# Altium schematic sheet 24_to_33V_(for_Ionizer_Chips).SchDoc
size A; SheetNumber: 1; SheetTotal: 2
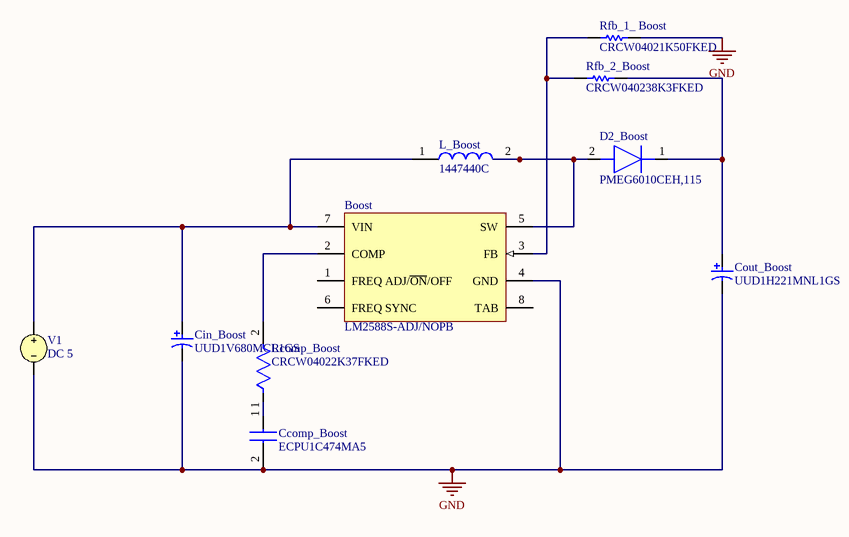
[diagram p0: 24_to_33V_(for_Ionizer_Chips).SchDoc]

## Parts
Boost  LM2588S-ADJ/NOPB  [KTW0007B_N]
Ccomp_Boost  ECPU1C474MA5  [ECPU1C154MA5]
Cin_Boost  UUD1V680MCL1GS  [NIC-CAPA2-6.3X7.7_V]
Cout_Boost  UUD1H221MNL1GS  [NIC-CAPA2-10X10_V]
D2_Boost  PMEG6010CEH,115  [SODFL3516X120N]
L_Boost  1447440C  [1447440C]
Rcomp_Boost  CRCW04022K37FKED  [FP-CRCW0402-e3-IPC_B]
Rfb_1__Boost  CRCW04021K50FKED  [RESC1005X40X25NL05T05]
Rfb_2_Boost  CRCW040238K3FKED  [RESC1005X40X25NL05T05]
V1  DC 5

## Nets
GND: Boost.4(GND) Ccomp_Boost.2 Cin_Boost.2 Cout_Boost.2 Rfb_1__Boost.2 V1.2
NetBoost_2: Boost.2(COMP) Rcomp_Boost.2
NetBoost_3: Boost.3(FB) Rfb_1__Boost.1 Rfb_2_Boost.1
NetBoost_5: Boost.5(SW) D2_Boost.2(A) L_Boost.2
NetBoost_7: Boost.7(VIN) Cin_Boost.1 L_Boost.1 V1.1
NetCcomp_Boost_1: Ccomp_Boost.1 Rcomp_Boost.1
NetCout_Boost_1: Cout_Boost.1 D2_Boost.1(K) Rfb_2_Boost.2

Not connected (* = marked no-connect by the designer): Boost 1(FREQ_ADJ/~{ON}/OFF) 6(FREQ_SYNC) 8(TAB)

## Library data of the parts
Boost = CMP-0069-00054-3: SIMPLE SWITCHER® 5A Flyback Regulator with Shutdown, 7-pin TO-263, Pb-Free; Manufacturer: Texas Instruments; PowerWise: N; PackageTopMarking: NSUZXYTTE#*LM2588S*-ADJ P+; PinCount: 7; PackageReference: KTW0007B; ComponentLink1Description: Datasheet URL; ComponentLink1URL: http://www.ti.com/general/docs/lit/getliterature.tsp?genericPartNumber=LM2588&fileType=pdf; Code_JEDEC: MO-169-AC; RoHS: Y; CompType: Switcher; PackageDescription: TO-263, Molded, .400 x .390 x .180in Body, 7 Lead, .050in Pitch, Surface Mount
Ccomp_Boost = ECPU1C474MA5: Capacitor; Manufacturer_Name: Panasonic; Datasheet Link: http://industrial.panasonic.com/cdbs/www-data/pdf/RDI0000/ABD0000C178.pdf; Manufacturer_Part_Number: ECPU1C474MA5
Cin_Boost = CMP-0687-00064-1: Aluminum Electrolytic Capacitor, UD Series, Low Impedance, 68 uF, 35 V, + / - 20%, -55 to 105 degC, Chip Type, 6.3 x 7.7 mm D x L, Pb-Free, Reel; Manufacturer: Nichicon; Rated Ripple Current (at 100kHz): 280 mA; Rated Capacitance: 68 uF; Impedance: 0.34 Ohm; Rated Voltage: 35 V; Packing: Dia382mm Reel; Endurance Time: 2000 h; Tolerance Rated Capacitance: -20 to 20%; Mounting Technology: Surface Mount; ComponentLink2URL: http://products.nichicon.co.jp/en/pdf/XJA043/e-ud.pdf; ComponentLink1Description: Manufacturer URL; PackageReference: CAPAE-D6.3H7.7; Diameter: 6.3 mm; PackageDescription: 2-Pin Surface Mount Device, Diameter 6.3 mm, Height 7.7 mm, Pitch 5.4 mm; ComponentLink2Description: Datasheet; ComponentLink3Description: Package Specification; RoHS: TRUE; Length: 7.7 mm; DatasheetVersion: 08/2012; ComponentLink1URL: http://www.nichicon.co.jp/; ComponentLink3URL: http://products.nichicon.co.jp/en/pdf/XJA043/e-ud.pdf; PartNumber: UUD1V680MCL1GS
Cout_Boost = CMP-0687-00004-1: Aluminum Electrolytic Capacitor, UD Series, Low Impedance, 220 uF, 50 V, + / - 20%, -55 to 105 degC, Chip Type, 10 x 10 mm D x L, Pb-Free, Reel; Manufacturer: Nichicon; Rated Capacitance: 220 uF; Packing: Dia382mm Reel; Endurance Time: 5000 h; Rated Ripple Current (at 100kHz): 670 mA; Tolerance Rated Capacitance: -20 to 20%; Rated Voltage: 50 V; Impedance: 0.18 Ohm; RoHS: TRUE; ComponentLink2URL: http://products.nichicon.co.jp/en/pdf/XJA043/e-ud.pdf; PartNumber: UUD1H221MNL1GS; ComponentLink3URL: http://products.nichicon.co.jp/en/pdf/XJA043/e-ud.pdf; Mounting Technology: Surface Mount; ComponentLink1Description: Manufacturer URL; ComponentLink3Description: Package Specification; ComponentLink1URL: http://www.nichicon.co.jp/; Diameter: 10 mm; PackageDescription: 2-Pin Surface Mount Device, Diameter 10 mm, Height 10 mm, Pitch 8 mm; PackageReference: CAPAE-D10H10; ComponentLink2Description: Datasheet; DatasheetVersion: 08/2012; Length: 10 mm
D2_Boost = PMEG6010CEH,115: Diode; Manufacturer_Name: Nexperia; Datasheet Link: https://assets.nexperia.com/documents/data-sheet/PMEG6010CEH_PMEG6010CEJ.pdf; Height: 1.2mm; Manufacturer_Part_Number: PMEG6010CEH,115; Mouser Part Number: 771-PMEG6010CEH-T/R; Mouser Price/Stock: https://www.mouser.co.uk/ProductDetail/Nexperia/PMEG6010CEH115?qs=LOCUfHb8d9uyulDQGIpcOA%3D%3D; Arrow Part Number: PMEG6010CEH,115; Arrow Price/Stock: https://www.arrow.com/en/products/pmeg6010ceh115/nexperia?region=europe
L_Boost = 1447440C: Inductor; Manufacturer_Name: Murata Electronics; Datasheet Link: https://www.arrow.com/en/products/1447440c/murata-power-solutions; Manufacturer_Part_Number: 1447440C; Mouser Part Number: 580-1447440C; Mouser Price/Stock: https://www.mouser.co.uk/ProductDetail/Murata-Power-Solutions/1447440C?qs=Gob89d8LFA9gyjWpYAyVrg%3D%3D; Arrow Part Number: 1447440C; Arrow Price/Stock: https://www.arrow.com/en/products/1447440c/murata-power-solutions
Rcomp_Boost = CMP-2002-08458-2: RES Thick Film, 2.37kΩ, 1%, 0.063W, 100ppm/°C, 0402; Voltage Rating: 50V; Power Rating: 63mW; Resistance: 2.37kR; Case Code (Metric): 1005; Height: 0.35mm; Features: Automotive AEC-Q200; Voltage Rating (DC): 50V; Radiation Hardening: No; Case Code (Imperial): 0402; Length: 1mm; Packaging: Tape and Reel; Composition: Thick Film; Min Operating Temperature: -55°C; Military Standard: Not; Number of Terminations: 2; Contact Plating: Tin; Lead Free: Lead Free; Max Operating Temperature: 155°C; Max Power Dissipation: 63mW; Termination: SMD/SMT; Width: 0.02inch; Temperature Coefficient: 100ppm/°C; Case/Package: 0402; Weight: 2.3E-05oz; Package Quantity: 10; Tolerance: 1%; Depth: 0.5mm
Rfb_1__Boost = CMP-2002-08297-1: Manufacturer: Vishay Dale; Part Number: CRCW04021K50FKED
Rfb_2_Boost = CMP-2002-08561-1: Manufacturer: Vishay Dale; Part Number: CRCW040238K3FKED
V1 = VSRC: Voltage Source; Note: PCB Footprint - Not required; AC Magnitude: 1; AC Phase: 0; Value: 5; Published: 8-Jun-2000; LatestRevisionDate: 17-Jul-2002; LatestRevisionNote: Re-released for DXP Platform.; PackageReference: Not Applicable; Publisher: Altium Limited